# Altium project SAMA5D27-SOM1.PrjPcb (part 2 of 2)

## Sheet 7-SOM PIO.SchDoc
size 420 x 297 mm; CompanyName: Microchip Technology Inc.; Organization: Microchip Technology; Address1: 2355 West Chandler Blvd.; Address2: Chandler, AZ  85224; Address4: USA; SheetTitle: **; Time: Time
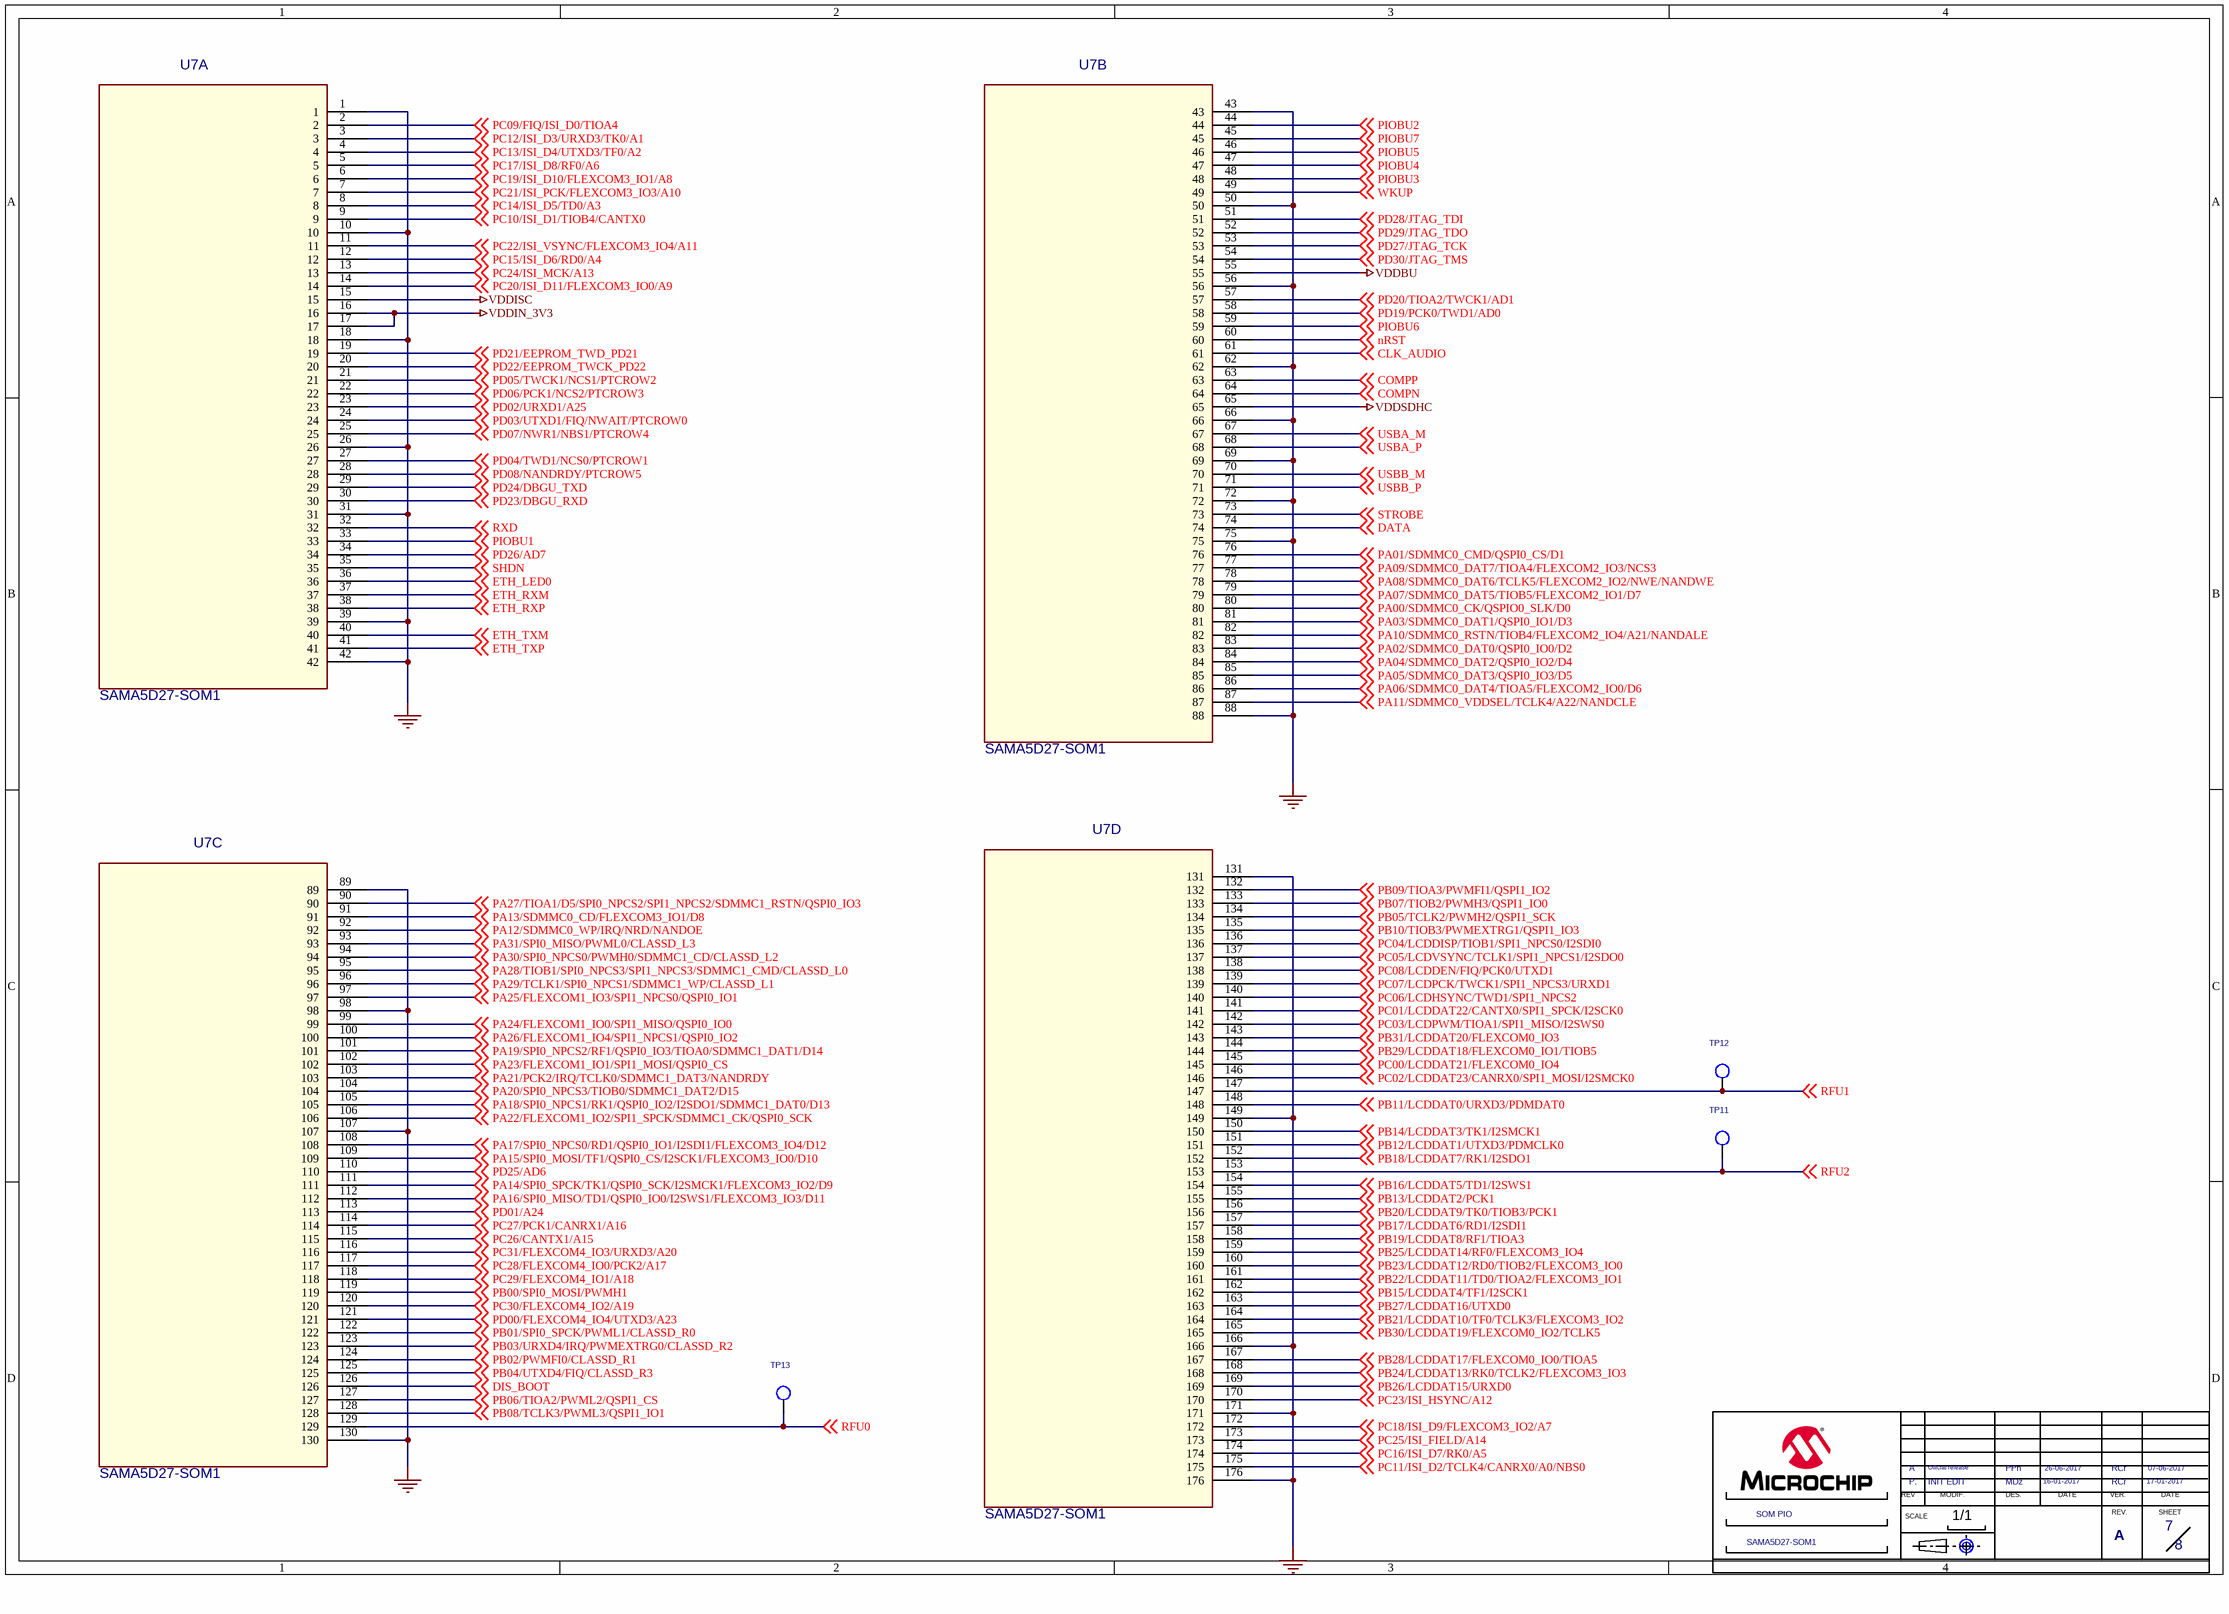
[diagram p6: 7-SOM PIO.SchDoc]

### Parts
(Parts that share a designator on the sheet are numbered #1, #2 ... from top to bottom, then left to right.)
*#7  MODIF.A: INIT EDIT  SHEET NAME 2: SOM PIO  SHEET NAME 1: SAMA5D27-SOM1  REV B: A  VERIF B: RCr  VERIF DATE A: 17-01-2017  VERIF DATE B: 07-06-2017  Page Count: 8  Page Number: 7  DATE A: 16-01-2017  DATE B: 26-06-2017  DES A: MDz  DES B: PPn  MODIF.B: Official release  REV A: P.  (hidden comment: CARTOUCHE MICROCHIP)  (graphical)
?#7  (no value)  (graphical)
TP11  TP  [tp-cmsrond-1mm_02]  (value not drawn)
TP12  TP  [tp-cmsrond-1mm_02]  (value not drawn)
TP13  TP  [tp-cmsrond-1mm_02]  (value not drawn)
U7  SAMA5D27-SOM1  [SAMA5D27-DXG-SOM1]  (parts A,B,C,D of 4)

### Nets
GND: U7.1 U7.10 U7.18 U7.26 U7.31 U7.39 U7.42 U7.43 U7.50 U7.56 U7.62 U7.66 U7.69 U7.72 U7.75 U7.88 U7.89 U7.98 U7.107 U7.130 U7.131 U7.149 U7.166 U7.171 U7.176
VDDBU: U7.55
VDDIN_3V3: U7.16 U7.17
VDDISC: U7.15
VDDSDHC: U7.65
CLK_AUDIO: U7.61 ; off-sheet CLK_AUDIO
COMPN: U7.64 ; off-sheet COMPN
COMPP: U7.63 ; off-sheet COMPP
DATA: U7.74 ; off-sheet DATA
DIS_BOOT: U7.126 ; off-sheet DIS_BOOT
ETH_LED0: U7.36 ; off-sheet ETH_LED0
ETH_RXM: U7.37 ; off-sheet ETH_RXM
ETH_RXP: U7.38 ; off-sheet ETH_RXP
ETH_TXM: U7.40 ; off-sheet ETH_TXM
ETH_TXP: U7.41 ; off-sheet ETH_TXP
nRST: U7.60 ; off-sheet nRST
PA00/SDMMC0_CK/QSPIO0_SLK/D0: U7.80 ; off-sheet PA00/SDMMC0_CK/QSPIO0_SLK/D0
PA01/SDMMC0_CMD/QSPI0_CS/D1: U7.76 ; off-sheet PA01/SDMMC0_CMD/QSPI0_CS/D1
PA02/SDMMC0_DAT0/QSPI0_IO0/D2: U7.83 ; off-sheet PA02/SDMMC0_DAT0/QSPI0_IO0/D2
PA03/SDMMC0_DAT1/QSPI0_IO1/D3: U7.81 ; off-sheet PA03/SDMMC0_DAT1/QSPI0_IO1/D3
PA04/SDMMC0_DAT2/QSPI0_IO2/D4: U7.84 ; off-sheet PA04/SDMMC0_DAT2/QSPI0_IO2/D4
PA05/SDMMC0_DAT3/QSPI0_IO3/D5: U7.85 ; off-sheet PA05/SDMMC0_DAT3/QSPI0_IO3/D5
PA06/SDMMC0_DAT4/TIOA5/FLEXCOM2_IO0/D6: U7.86 ; off-sheet PA06/SDMMC0_DAT4/TIOA5/FLEXCOM2_IO0/D6
PA07/SDMMC0_DAT5/TIOB5/FLEXCOM2_IO1/D7: U7.79 ; off-sheet PA07/SDMMC0_DAT5/TIOB5/FLEXCOM2_IO1/D7
PA08/SDMMC0_DAT6/TCLK5/FLEXCOM2_IO2/NWE/NANDWE: U7.78 ; off-sheet PA08/SDMMC0_DAT6/TCLK5/FLEXCOM2_IO2/NWE/NANDWE
PA09/SDMMC0_DAT7/TIOA4/FLEXCOM2_IO3/NCS3: U7.77 ; off-sheet PA09/SDMMC0_DAT7/TIOA4/FLEXCOM2_IO3/NCS3
PA10/SDMMC0_RSTN/TIOB4/FLEXCOM2_IO4/A21/NANDALE: U7.82 ; off-sheet PA10/SDMMC0_RSTN/TIOB4/FLEXCOM2_IO4/A21/NANDALE
PA11/SDMMC0_VDDSEL/TCLK4/A22/NANDCLE: U7.87 ; off-sheet PA11/SDMMC0_VDDSEL/TCLK4/A22/NANDCLE
PA12/SDMMC0_WP/IRQ/NRD/NANDOE: U7.92 ; off-sheet PA12/SDMMC0_WP/IRQ/NRD/NANDOE
PA13/SDMMC0_CD/FLEXCOM3_IO1/D8: U7.91 ; off-sheet PA13/SDMMC0_CD/FLEXCOM3_IO1/D8
PA14/SPI0_SPCK/TK1/QSPI0_SCK/I2SMCK1/FLEXCOM3_IO2/D9: U7.111 ; off-sheet PA14/SPI0_SPCK/TK1/QSPI0_SCK/I2SMCK1/FLEXCOM3_IO2/D9
PA15/SPI0_MOSI/TF1/QSPI0_CS/I2SCK1/FLEXCOM3_IO0/D10: U7.109 ; off-sheet PA15/SPI0_MOSI/TF1/QSPI0_CS/I2SCK1/FLEXCOM3_IO0/D10
PA16/SPI0_MISO/TD1/QSPI0_IO0/I2SWS1/FLEXCOM3_IO3/D11: U7.112 ; off-sheet PA16/SPI0_MISO/TD1/QSPI0_IO0/I2SWS1/FLEXCOM3_IO3/D11
PA17/SPI0_NPCS0/RD1/QSPI0_IO1/I2SDI1/FLEXCOM3_IO4/D12: U7.108 ; off-sheet PA17/SPI0_NPCS0/RD1/QSPI0_IO1/I2SDI1/FLEXCOM3_IO4/D12
PA18/SPI0_NPCS1/RK1/QSPI0_IO2/I2SDO1/SDMMC1_DAT0/D13: U7.105 ; off-sheet PA18/SPI0_NPCS1/RK1/QSPI0_IO2/I2SDO1/SDMMC1_DAT0/D13
PA19/SPI0_NPCS2/RF1/QSPI0_IO3/TIOA0/SDMMC1_DAT1/D14: U7.101 ; off-sheet PA19/SPI0_NPCS2/RF1/QSPI0_IO3/TIOA0/SDMMC1_DAT1/D14
PA20/SPI0_NPCS3/TIOB0/SDMMC1_DAT2/D15: U7.104 ; off-sheet PA20/SPI0_NPCS3/TIOB0/SDMMC1_DAT2/D15
PA21/PCK2/IRQ/TCLK0/SDMMC1_DAT3/NANDRDY: U7.103 ; off-sheet PA21/PCK2/IRQ/TCLK0/SDMMC1_DAT3/NANDRDY
PA22/FLEXCOM1_IO2/SPI1_SPCK/SDMMC1_CK/QSPI0_SCK: U7.106 ; off-sheet PA22/FLEXCOM1_IO2/SPI1_SPCK/SDMMC1_CK/QSPI0_SCK
PA23/FLEXCOM1_IO1/SPI1_MOSI/QSPI0_CS: U7.102 ; off-sheet PA23/FLEXCOM1_IO1/SPI1_MOSI/QSPI0_CS
PA24/FLEXCOM1_IO0/SPI1_MISO/QSPI0_IO0: U7.99 ; off-sheet PA24/FLEXCOM1_IO0/SPI1_MISO/QSPI0_IO0
PA25/FLEXCOM1_IO3/SPI1_NPCS0/QSPI0_IO1: U7.97 ; off-sheet PA25/FLEXCOM1_IO3/SPI1_NPCS0/QSPI0_IO1
PA26/FLEXCOM1_IO4/SPI1_NPCS1/QSPI0_IO2: U7.100 ; off-sheet PA26/FLEXCOM1_IO4/SPI1_NPCS1/QSPI0_IO2
PA27/TIOA1/D5/SPI0_NPCS2/SPI1_NPCS2/SDMMC1_RSTN/QSPI0_IO3: U7.90 ; off-sheet PA27/TIOA1/D5/SPI0_NPCS2/SPI1_NPCS2/SDMMC1_RSTN/QSPI0_IO3
PA28/TIOB1/SPI0_NPCS3/SPI1_NPCS3/SDMMC1_CMD/CLASSD_L0: U7.95 ; off-sheet PA28/TIOB1/SPI0_NPCS3/SPI1_NPCS3/SDMMC1_CMD/CLASSD_L0
PA29/TCLK1/SPI0_NPCS1/SDMMC1_WP/CLASSD_L1: U7.96 ; off-sheet PA29/TCLK1/SPI0_NPCS1/SDMMC1_WP/CLASSD_L1
PA30/SPI0_NPCS0/PWMH0/SDMMC1_CD/CLASSD_L2: U7.94 ; off-sheet PA30/SPI0_NPCS0/PWMH0/SDMMC1_CD/CLASSD_L2
PA31/SPI0_MISO/PWML0/CLASSD_L3: U7.93 ; off-sheet PA31/SPI0_MISO/PWML0/CLASSD_L3
PB00/SPI0_MOSI/PWMH1: U7.119 ; off-sheet PB00/SPI0_MOSI/PWMH1
PB01/SPI0_SPCK/PWML1/CLASSD_R0: U7.122 ; off-sheet PB01/SPI0_SPCK/PWML1/CLASSD_R0
PB02/PWMFI0/CLASSD_R1: U7.124 ; off-sheet PB02/PWMFI0/CLASSD_R1
PB03/URXD4/IRQ/PWMEXTRG0/CLASSD_R2: U7.123 ; off-sheet PB03/URXD4/IRQ/PWMEXTRG0/CLASSD_R2
PB04/UTXD4/FIQ/CLASSD_R3: U7.125 ; off-sheet PB04/UTXD4/FIQ/CLASSD_R3
PB05/TCLK2/PWMH2/QSPI1_SCK: U7.134 ; off-sheet PB05/TCLK2/PWMH2/QSPI1_SCK
PB06/TIOA2/PWML2/QSPI1_CS: U7.127 ; off-sheet PB06/TIOA2/PWML2/QSPI1_CS
PB07/TIOB2/PWMH3/QSPI1_IO0: U7.133 ; off-sheet PB07/TIOB2/PWMH3/QSPI1_IO0
PB08/TCLK3/PWML3/QSPI1_IO1: U7.128 ; off-sheet PB08/TCLK3/PWML3/QSPI1_IO1
PB09/TIOA3/PWMFI1/QSPI1_IO2: U7.132 ; off-sheet PB09/TIOA3/PWMFI1/QSPI1_IO2
PB10/TIOB3/PWMEXTRG1/QSPI1_IO3: U7.135 ; off-sheet PB10/TIOB3/PWMEXTRG1/QSPI1_IO3
PB11/LCDDAT0/URXD3/PDMDAT0: U7.148 ; off-sheet PB11/LCDDAT0/URXD3/PDMDAT0
PB12/LCDDAT1/UTXD3/PDMCLK0: U7.151 ; off-sheet PB12/LCDDAT1/UTXD3/PDMCLK0
PB13/LCDDAT2/PCK1: U7.155 ; off-sheet PB13/LCDDAT2/PCK1
PB14/LCDDAT3/TK1/I2SMCK1: U7.150 ; off-sheet PB14/LCDDAT3/TK1/I2SMCK1
PB15/LCDDAT4/TF1/I2SCK1: U7.162 ; off-sheet PB15/LCDDAT4/TF1/I2SCK1
PB16/LCDDAT5/TD1/I2SWS1: U7.154 ; off-sheet PB16/LCDDAT5/TD1/I2SWS1
PB17/LCDDAT6/RD1/I2SDI1: U7.157 ; off-sheet PB17/LCDDAT6/RD1/I2SDI1
PB18/LCDDAT7/RK1/I2SDO1: U7.152 ; off-sheet PB18/LCDDAT7/RK1/I2SDO1
PB19/LCDDAT8/RF1/TIOA3: U7.158 ; off-sheet PB19/LCDDAT8/RF1/TIOA3
PB20/LCDDAT9/TK0/TIOB3/PCK1: U7.156 ; off-sheet PB20/LCDDAT9/TK0/TIOB3/PCK1
PB21/LCDDAT10/TF0/TCLK3/FLEXCOM3_IO2: U7.164 ; off-sheet PB21/LCDDAT10/TF0/TCLK3/FLEXCOM3_IO2
PB22/LCDDAT11/TD0/TIOA2/FLEXCOM3_IO1: U7.161 ; off-sheet PB22/LCDDAT11/TD0/TIOA2/FLEXCOM3_IO1
PB23/LCDDAT12/RD0/TIOB2/FLEXCOM3_IO0: U7.160 ; off-sheet PB23/LCDDAT12/RD0/TIOB2/FLEXCOM3_IO0
PB24/LCDDAT13/RK0/TCLK2/FLEXCOM3_IO3: U7.168 ; off-sheet PB24/LCDDAT13/RK0/TCLK2/FLEXCOM3_IO3
PB25/LCDDAT14/RF0/FLEXCOM3_IO4: U7.159 ; off-sheet PB25/LCDDAT14/RF0/FLEXCOM3_IO4
PB26/LCDDAT15/URXD0: U7.169 ; off-sheet PB26/LCDDAT15/URXD0
PB27/LCDDAT16/UTXD0: U7.163 ; off-sheet PB27/LCDDAT16/UTXD0
PB28/LCDDAT17/FLEXCOM0_IO0/TIOA5: U7.167 ; off-sheet PB28/LCDDAT17/FLEXCOM0_IO0/TIOA5
PB29/LCDDAT18/FLEXCOM0_IO1/TIOB5: U7.144 ; off-sheet PB29/LCDDAT18/FLEXCOM0_IO1/TIOB5
PB30/LCDDAT19/FLEXCOM0_IO2/TCLK5: U7.165 ; off-sheet PB30/LCDDAT19/FLEXCOM0_IO2/TCLK5
PB31/LCDDAT20/FLEXCOM0_IO3: U7.143 ; off-sheet PB31/LCDDAT20/FLEXCOM0_IO3
PC00/LCDDAT21/FLEXCOM0_IO4: U7.145 ; off-sheet PC00/LCDDAT21/FLEXCOM0_IO4
PC01/LCDDAT22/CANTX0/SPI1_SPCK/I2SCK0: U7.141 ; off-sheet PC01/LCDDAT22/CANTX0/SPI1_SPCK/I2SCK0
PC02/LCDDAT23/CANRX0/SPI1_MOSI/I2SMCK0: U7.146 ; off-sheet PC02/LCDDAT23/CANRX0/SPI1_MOSI/I2SMCK0
PC03/LCDPWM/TIOA1/SPI1_MISO/I2SWS0: U7.142 ; off-sheet PC03/LCDPWM/TIOA1/SPI1_MISO/I2SWS0
PC04/LCDDISP/TIOB1/SPI1_NPCS0/I2SDI0: U7.136 ; off-sheet PC04/LCDDISP/TIOB1/SPI1_NPCS0/I2SDI0
PC05/LCDVSYNC/TCLK1/SPI1_NPCS1/I2SDO0: U7.137 ; off-sheet PC05/LCDVSYNC/TCLK1/SPI1_NPCS1/I2SDO0
PC06/LCDHSYNC/TWD1/SPI1_NPCS2: U7.140 ; off-sheet PC06/LCDHSYNC/TWD1/SPI1_NPCS2
PC07/LCDPCK/TWCK1/SPI1_NPCS3/URXD1: U7.139 ; off-sheet PC07/LCDPCK/TWCK1/SPI1_NPCS3/URXD1
PC08/LCDDEN/FIQ/PCK0/UTXD1: U7.138 ; off-sheet PC08/LCDDEN/FIQ/PCK0/UTXD1
PC09/FIQ/ISI_D0/TIOA4: U7.2 ; off-sheet PC09/FIQ/ISI_D0/TIOA4
PC10/ISI_D1/TIOB4/CANTX0: U7.9 ; off-sheet PC10/ISI_D1/TIOB4/CANTX0
PC11/ISI_D2/TCLK4/CANRX0/A0/NBS0: U7.175 ; off-sheet PC11/ISI_D2/TCLK4/CANRX0/A0/NBS0
PC12/ISI_D3/URXD3/TK0/A1: U7.3 ; off-sheet PC12/ISI_D3/URXD3/TK0/A1
PC13/ISI_D4/UTXD3/TF0/A2: U7.4 ; off-sheet PC13/ISI_D4/UTXD3/TF0/A2
PC14/ISI_D5/TD0/A3: U7.8 ; off-sheet PC14/ISI_D5/TD0/A3
PC15/ISI_D6/RD0/A4: U7.12 ; off-sheet PC15/ISI_D6/RD0/A4
PC16/ISI_D7/RK0/A5: U7.174 ; off-sheet PC16/ISI_D7/RK0/A5
PC17/ISI_D8/RF0/A6: U7.5 ; off-sheet PC17/ISI_D8/RF0/A6
PC18/ISI_D9/FLEXCOM3_IO2/A7: U7.172 ; off-sheet PC18/ISI_D9/FLEXCOM3_IO2/A7
PC19/ISI_D10/FLEXCOM3_IO1/A8: U7.6 ; off-sheet PC19/ISI_D10/FLEXCOM3_IO1/A8
PC20/ISI_D11/FLEXCOM3_IO0/A9: U7.14 ; off-sheet PC20/ISI_D11/FLEXCOM3_IO0/A9
PC21/ISI_PCK/FLEXCOM3_IO3/A10: U7.7 ; off-sheet PC21/ISI_PCK/FLEXCOM3_IO3/A10
PC22/ISI_VSYNC/FLEXCOM3_IO4/A11: U7.11 ; off-sheet PC22/ISI_VSYNC/FLEXCOM3_IO4/A11
PC23/ISI_HSYNC/A12: U7.170 ; off-sheet PC23/ISI_HSYNC/A12
PC24/ISI_MCK/A13: U7.13 ; off-sheet PC24/ISI_MCK/A13
PC25/ISI_FIELD/A14: U7.173 ; off-sheet PC25/ISI_FIELD/A14
PC26/CANTX1/A15: U7.115 ; off-sheet PC26/CANTX1/A15
PC27/PCK1/CANRX1/A16: U7.114 ; off-sheet PC27/PCK1/CANRX1/A16
PC28/FLEXCOM4_IO0/PCK2/A17: U7.117 ; off-sheet PC28/FLEXCOM4_IO0/PCK2/A17
PC29/FLEXCOM4_IO1/A18: U7.118 ; off-sheet PC29/FLEXCOM4_IO1/A18
PC30/FLEXCOM4_IO2/A19: U7.120 ; off-sheet PC30/FLEXCOM4_IO2/A19
PC31/FLEXCOM4_IO3/URXD3/A20: U7.116 ; off-sheet PC31/FLEXCOM4_IO3/URXD3/A20
PD00/FLEXCOM4_IO4/UTXD3/A23: U7.121 ; off-sheet PD00/FLEXCOM4_IO4/UTXD3/A23
PD01/A24: U7.113 ; off-sheet PD01/A24
PD02/URXD1/A25: U7.23 ; off-sheet PD02/URXD1/A25
PD03/UTXD1/FIQ/NWAIT/PTCROW0: U7.24 ; off-sheet PD03/UTXD1/FIQ/NWAIT/PTCROW0
PD04/TWD1/NCS0/PTCROW1: U7.27 ; off-sheet PD04/TWD1/NCS0/PTCROW1
PD05/TWCK1/NCS1/PTCROW2: U7.21 ; off-sheet PD05/TWCK1/NCS1/PTCROW2
PD06/PCK1/NCS2/PTCROW3: U7.22 ; off-sheet PD06/PCK1/NCS2/PTCROW3
PD07/NWR1/NBS1/PTCROW4: U7.25 ; off-sheet PD07/NWR1/NBS1/PTCROW4
PD08/NANDRDY/PTCROW5: U7.28 ; off-sheet PD08/NANDRDY/PTCROW5
PD19/PCK0/TWD1/AD0: U7.58 ; off-sheet PD19/PCK0/TWD1/AD0
PD20/TIOA2/TWCK1/AD1: U7.57 ; off-sheet PD20/TIOA2/TWCK1/AD1
PD21/EEPROM_TWD_PD21: U7.19 ; off-sheet PD21/EEPROM_TWD_PD21
PD22/EEPROM_TWCK_PD22: U7.20 ; off-sheet PD22/EEPROM_TWCK_PD22
PD23/DBGU_RXD: U7.30 ; off-sheet PD23/DBGU_RXD
PD24/DBGU_TXD: U7.29 ; off-sheet PD24/DBGU_TXD
PD25/AD6: U7.110 ; off-sheet PD25/AD6
PD26/AD7: U7.34 ; off-sheet PD26/AD7
PD27/JTAG_TCK: U7.53 ; off-sheet PD27/JTAG_TCK
PD28/JTAG_TDI: U7.51 ; off-sheet PD28/JTAG_TDI
PD29/JTAG_TDO: U7.52 ; off-sheet PD29/JTAG_TDO
PD30/JTAG_TMS: U7.54 ; off-sheet PD30/JTAG_TMS
PIOBU1: U7.33 ; off-sheet PIOBU1
PIOBU2: U7.44 ; off-sheet PIOBU2
PIOBU3: U7.48 ; off-sheet PIOBU3
PIOBU4: U7.47 ; off-sheet PIOBU4
PIOBU5: U7.46 ; off-sheet PIOBU5
PIOBU6: U7.59 ; off-sheet PIOBU6
PIOBU7: U7.45 ; off-sheet PIOBU7
RFU0: TP13.1 U7.129 ; off-sheet RFU0
RFU1: TP12.1 U7.147 ; off-sheet RFU1
RFU2: TP11.1 U7.153 ; off-sheet RFU2
RXD: U7.32 ; off-sheet RXD
SHDN: U7.35 ; off-sheet SHDN
STROBE: U7.73 ; off-sheet STROBE
USBA_M: U7.67 ; off-sheet USBA_M
USBA_P: U7.68 ; off-sheet USBA_P
USBB_M: U7.70 ; off-sheet USBB_M
USBB_P: U7.71 ; off-sheet USBB_P
WKUP: U7.49 ; off-sheet WKUP

### Notes on the sheet
- Drawn By:
- Engineer:
- PartNumber:
- Project Title
- Sheet Title
- Size
- B
- Revision:
- Sch #:
- Date:
- Sheet
- Designed with
- Altium.com <http://go.altium.com/MicrochipLandingPage_Evaluation.html>
- File:
- (in symbol CARTOUCHE MICROCHIP) REV; MODIF.; DES.; DATE; VER.; SCALE; REV.; SHEET; 1/1

### Library data of the parts
*#7 = CARTOUCHE MICROCHIP: REV D: D; REV C: C; REV F: F; REV E: E; VERIF F: XXX; VERIF DATE F: XX-XXX-XX; MODIF.C: RevC; MODIF.D: RevD; MODIF.E: RevE; MODIF.F: RevF; VERIF E: XXX; VERIF D: XXX; VERIF C: RCr; VERIF A: RCr; VERIF DATE E: XX-XXX-XX; VERIF DATE D: XX-XXX-XX; VERIF DATE C: 07-06-2017; REV: A; FT: ?; Page Size: A; Page Create Date: june 19, 2004; DATE C: 07-06-2017; DATE D: XX-XXX-XX; DATE E: XX-XXX-XX; DATE F: XX-XXX-XX; DES E: XXX; DES F: XXX; DES C: XXX; DES D: XXX
?#7 = Title Block B
TP11-TP13 = TP: DESIGNATION: POINT DE TEST
U7 = SAMA5D27-SOM1-2

## Sheet 8-Mechanical.SchDoc
size 420 x 297 mm; CompanyName: Microchip Technology Inc.; Organization: Microchip Technology; Address1: 2355 West Chandler Blvd.; Address2: Chandler, AZ  85224; Address4: USA; SheetTitle: **; Time: Time
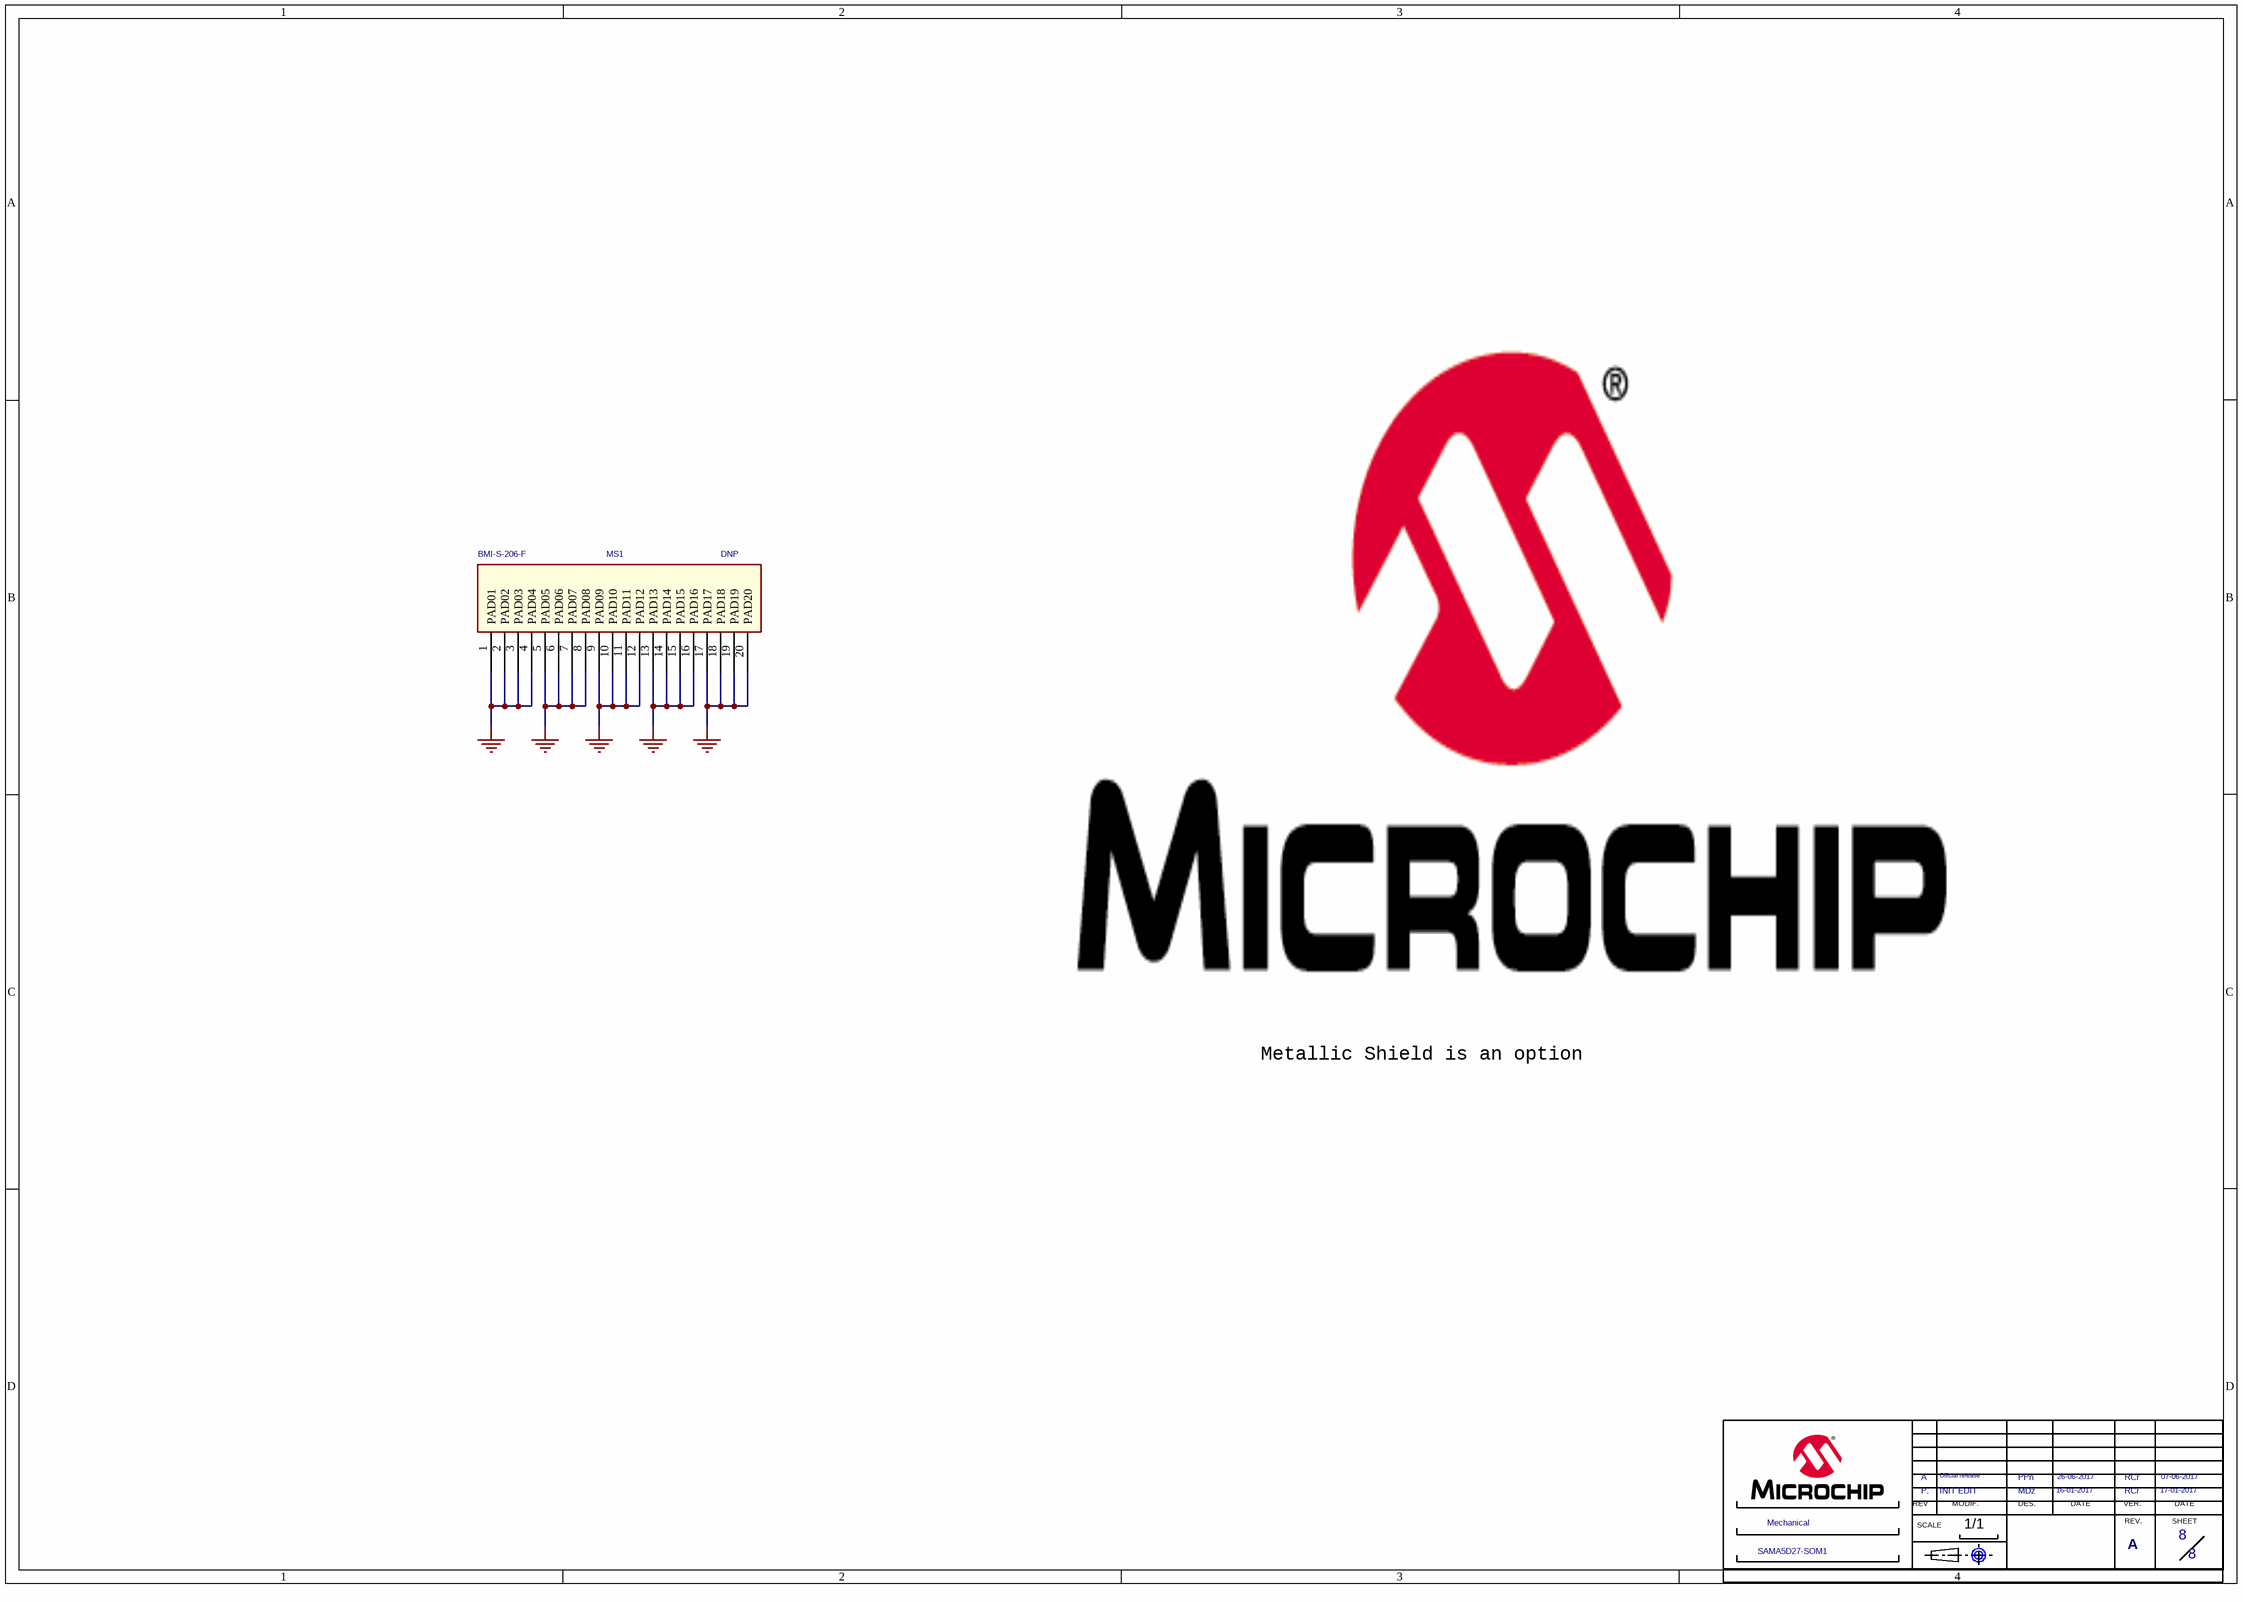
[diagram p7: 8-Mechanical.SchDoc]

### Parts
(Parts that share a designator on the sheet are numbered #1, #2 ... from top to bottom, then left to right.)
*#8  MODIF.A: INIT EDIT  SHEET NAME 2: Mechanical  SHEET NAME 1: SAMA5D27-SOM1  REV B: A  VERIF B: RCr  VERIF DATE A: 17-01-2017  VERIF DATE B: 07-06-2017  Page Count: 8  DATE A: 16-01-2017  DATE B: 26-06-2017  DES A: MDz  DES B: PPn  MODIF.B: Official release  REV A: P.  (hidden comment: CARTOUCHE MICROCHIP)  (graphical)
?#8  (no value)  (graphical)
MS1  ?  [BMI-S-206-F_01]  (value not drawn)

### Nets
GND: MS1.1(PAD01) MS1.2(PAD02) MS1.3(PAD03) MS1.4(PAD04) MS1.5(PAD05) MS1.6(PAD06) MS1.7(PAD07) MS1.8(PAD08) MS1.9(PAD09) MS1.10(PAD10) MS1.11(PAD11) MS1.12(PAD12) MS1.13(PAD13) MS1.14(PAD14) MS1.15(PAD15) MS1.16(PAD16) MS1.17(PAD17) MS1.18(PAD18) MS1.19(PAD19) MS1.20(PAD20)

### Notes on the sheet
- Metallic Shield is an option
- Drawn By:
- Engineer:
- PartNumber:
- Project Title
- Sheet Title
- Size
- B
- Revision:
- Sch #:
- Date:
- Sheet
- Designed with
- Altium.com <http://go.altium.com/MicrochipLandingPage_Evaluation.html>
- File:
- (in symbol CARTOUCHE MICROCHIP) REV; MODIF.; DES.; DATE; VER.; SCALE; REV.; SHEET; 1/1

### Library data of the parts
*#8 = CARTOUCHE MICROCHIP: as *#7 on sheet 7-SOM PIO; VERIF E: XXX; VERIF D: XXX; VERIF C: RCr; VERIF A: RCr; VERIF DATE E: XX-XXX-XX; VERIF DATE D: XX-XXX-XX; VERIF DATE C: 07-06-2017; REV: A; FT: ?; Page Number: 8; Page Size: A; Page Create Date: june 19, 2004; DATE C: 07-06-2017; DATE D: XX-XXX-XX; DATE E: XX-XXX-XX; DATE F: XX-XXX-XX; DES E: XXX; DES F: XXX; DES C: XXX; DES D: XXX
?#8 = Title Block B
MS1 = BMI-S-206-F: FABRICANT: Laird Technology; DESIGNATION: Metallic shield frame; Valeur: BMI-S-206-F; partnumber: BMI-S-206-F; type: ???; DNP: DNP

## Nets that join several sheets
GND: 2-Supplies (14 pins), 4-Microcontroller (86 pins), 5-Memories (44 pins), 6-Ethernet (14 pins), 7-SOM PIO (25 pins), 8-Mechanical (20 pins)
VDDBU: 2-Supplies (R1.2 R4.2), 4-Microcontroller (C58.2 U2.U5), 7-SOM PIO (U7.55)
VDDCORE: 2-Supplies (C8.2 U1.11), 4-Microcontroller (23 pins)
VDDFUSE: 2-Supplies (C1.1 U1.8), 4-Microcontroller (C57.2 TP5.1 U2.N13)
VDDIN_3V3: 2-Supplies (5 pins), 4-Microcontroller (8 pins), 5-Memories (16 pins), 6-Ethernet (7 pins), 7-SOM PIO (U7.16 U7.17)
VDDIODDR: 2-Supplies (5 pins), 4-Microcontroller (23 pins), 5-Memories (38 pins)
VDDISC: 4-Microcontroller (C55.2 U2.H3), 7-SOM PIO (U7.15)
VDDSDHC: 4-Microcontroller (C56.2 U2.N8), 7-SOM PIO (U7.65)
CLK_AUDIO: 4-Microcontroller (U2.T8), 7-SOM PIO (U7.61)
COMPN: 4-Microcontroller (R16.2), 7-SOM PIO (U7.64)
COMPP: 4-Microcontroller (R13.2), 7-SOM PIO (U7.63)
DATA: 4-Microcontroller (U2.T12), 7-SOM PIO (U7.74)
DIS_BOOT: 5-Memories (R33.2 U5.1), 7-SOM PIO (U7.126)
EEPROM_TWCK_PD22: 3-Microcontroller (U2.L6), 5-Memories (R22.1 R24.2 R26.2)
EEPROM_TWD_PD21: 3-Microcontroller (U2.P1), 5-Memories (R23.1 R25.2 R27.2)
ETH_INT_IRQ_PD31: 3-Microcontroller (U2.M8), 6-Ethernet (R48.1 U6.18)
ETH_LED0: 6-Ethernet (R52.1 U6.23), 7-SOM PIO (U7.36)
ETH_RXM: 6-Ethernet (U6.3), 7-SOM PIO (U7.37)
ETH_RXP: 6-Ethernet (U6.4), 7-SOM PIO (U7.38)
ETH_TXM: 6-Ethernet (U6.5), 7-SOM PIO (U7.40)
ETH_TXP: 6-Ethernet (U6.6), 7-SOM PIO (U7.41)
GMDC_PD17: 3-Microcontroller (U2.K1), 6-Ethernet (U6.11)
GMDIO_PD18: 3-Microcontroller (U2.J7), 6-Ethernet (R49.1 U6.10)
GRX0_PD13: 3-Microcontroller (U2.N1), 6-Ethernet (U6.13)
GRX1_PD14: 3-Microcontroller (U2.K5), 6-Ethernet (U6.12)
GRXDV_PD11: 3-Microcontroller (U2.K2), 6-Ethernet (R51.2 U6.15)
GRXER_PD12: 3-Microcontroller (U2.K9), 6-Ethernet (U6.17)
GTX0_PD15: 3-Microcontroller (U2.K8), 6-Ethernet (U6.20)
GTX1_PD16: 3-Microcontroller (U2.L1), 6-Ethernet (U6.21)
GTXCK_PD09: 3-Microcontroller (U2.J4), 6-Ethernet (U6.16)
GTXEN_PD10: 3-Microcontroller (U2.J3), 6-Ethernet (U6.19)
LOWQ#: 2-Supplies (R1.1 U1.1), 4-Microcontroller (U2.P3)
nRST: 2-Supplies (Q1.3 R2.1 U1.12), 4-Microcontroller (R10.1), 6-Ethernet (R53.2), 7-SOM PIO (U7.60)
PA00/SDMMC0_CK/QSPIO0_SLK/D0: 3-Microcontroller (U2.U13), 7-SOM PIO (U7.80)
PA01/SDMMC0_CMD/QSPI0_CS/D1: 3-Microcontroller (U2.N7), 7-SOM PIO (U7.76)
PA02/SDMMC0_DAT0/QSPI0_IO0/D2: 3-Microcontroller (U2.U14), 7-SOM PIO (U7.83)
PA03/SDMMC0_DAT1/QSPI0_IO1/D3: 3-Microcontroller (U2.T13), 7-SOM PIO (U7.81)
PA04/SDMMC0_DAT2/QSPI0_IO2/D4: 3-Microcontroller (U2.U15), 7-SOM PIO (U7.84)
PA05/SDMMC0_DAT3/QSPI0_IO3/D5: 3-Microcontroller (U2.U16), 7-SOM PIO (U7.85)
PA06/SDMMC0_DAT4/TIOA5/FLEXCOM2_IO0/D6: 3-Microcontroller (U2.U17), 7-SOM PIO (U7.86)
PA07/SDMMC0_DAT5/TIOB5/FLEXCOM2_IO1/D7: 3-Microcontroller (U2.R11), 7-SOM PIO (U7.79)
PA08/SDMMC0_DAT6/TCLK5/FLEXCOM2_IO2/NWE/NANDWE: 3-Microcontroller (U2.R9), 7-SOM PIO (U7.78)
PA09/SDMMC0_DAT7/TIOA4/FLEXCOM2_IO3/NCS3: 3-Microcontroller (U2.P8), 7-SOM PIO (U7.77)
PA10/SDMMC0_RSTN/TIOB4/FLEXCOM2_IO4/A21/NANDALE: 3-Microcontroller (U2.R10), 7-SOM PIO (U7.82)
PA11/SDMMC0_VDDSEL/TCLK4/A22/NANDCLE: 3-Microcontroller (U2.P15), 7-SOM PIO (U7.87)
PA12/SDMMC0_WP/IRQ/NRD/NANDOE: 3-Microcontroller (U2.N17), 7-SOM PIO (U7.92)
PA13/SDMMC0_CD/FLEXCOM3_IO1/D8: 3-Microcontroller (U2.P16), 7-SOM PIO (U7.91)
PA14/SPI0_SPCK/TK1/QSPI0_SCK/I2SMCK1/FLEXCOM3_IO2/D9: 3-Microcontroller (U2.M17), 7-SOM PIO (U7.111)
PA15/SPI0_MOSI/TF1/QSPI0_CS/I2SCK1/FLEXCOM3_IO0/D10: 3-Microcontroller (U2.N16), 7-SOM PIO (U7.109)
PA16/SPI0_MISO/TD1/QSPI0_IO0/I2SWS1/FLEXCOM3_IO3/D11: 3-Microcontroller (U2.M11), 7-SOM PIO (U7.112)
PA17/SPI0_NPCS0/RD1/QSPI0_IO1/I2SDI1/FLEXCOM3_IO4/D12: 3-Microcontroller (U2.N14), 7-SOM PIO (U7.108)
PA18/SPI0_NPCS1/RK1/QSPI0_IO2/I2SDO1/SDMMC1_DAT0/D13: 3-Microcontroller (U2.T16), 7-SOM PIO (U7.105)
PA19/SPI0_NPCS2/RF1/QSPI0_IO3/TIOA0/SDMMC1_DAT1/D14: 3-Microcontroller (U2.T15), 7-SOM PIO (U7.101)
PA20/SPI0_NPCS3/TIOB0/SDMMC1_DAT2/D15: 3-Microcontroller (U2.P9), 7-SOM PIO (U7.104)
PA21/PCK2/IRQ/TCLK0/SDMMC1_DAT3/NANDRDY: 3-Microcontroller (U2.P10), 7-SOM PIO (U7.103)
PA22/FLEXCOM1_IO2/SPI1_SPCK/SDMMC1_CK/QSPI0_SCK: 3-Microcontroller (U2.T17), 7-SOM PIO (U7.106)
PA23/FLEXCOM1_IO1/SPI1_MOSI/QSPI0_CS: 3-Microcontroller (U2.T14), 7-SOM PIO (U7.102)
PA24/FLEXCOM1_IO0/SPI1_MISO/QSPI0_IO0: 3-Microcontroller (U2.R17), 7-SOM PIO (U7.99)
PA25/FLEXCOM1_IO3/SPI1_NPCS0/QSPI0_IO1: 3-Microcontroller (U2.R16), 7-SOM PIO (U7.97)
PA26/FLEXCOM1_IO4/SPI1_NPCS1/QSPI0_IO2: 3-Microcontroller (U2.P17), 7-SOM PIO (U7.100)
PA27/TIOA1/D5/SPI0_NPCS2/SPI1_NPCS2/SDMMC1_RSTN/QSPI0_IO3: 3-Microcontroller (U2.R15), 7-SOM PIO (U7.90)
PA28/TIOB1/SPI0_NPCS3/SPI1_NPCS3/SDMMC1_CMD/CLASSD_L0: 3-Microcontroller (U2.R14), 7-SOM PIO (U7.95)
PA29/TCLK1/SPI0_NPCS1/SDMMC1_WP/CLASSD_L1: 3-Microcontroller (U2.P14), 7-SOM PIO (U7.96)
PA30/SPI0_NPCS0/PWMH0/SDMMC1_CD/CLASSD_L2: 3-Microcontroller (U2.R13), 7-SOM PIO (U7.94)
PA31/SPI0_MISO/PWML0/CLASSD_L3: 3-Microcontroller (U2.P13), 7-SOM PIO (U7.93)
PB00/SPI0_MOSI/PWMH1: 3-Microcontroller (U2.F5), 7-SOM PIO (U7.119)
PB01/SPI0_SPCK/PWML1/CLASSD_R0: 3-Microcontroller (U2.C8), 7-SOM PIO (U7.122)
PB02/PWMFI0/CLASSD_R1: 3-Microcontroller (U2.C7), 7-SOM PIO (U7.124)
PB03/URXD4/IRQ/PWMEXTRG0/CLASSD_R2: 3-Microcontroller (U2.B8), 7-SOM PIO (U7.123)
PB04/UTXD4/FIQ/CLASSD_R3: 3-Microcontroller (U2.B7), 7-SOM PIO (U7.125)
PB05/TCLK2/PWMH2/QSPI1_SCK: 5-Memories (R47.2), 7-SOM PIO (U7.134)
PB06/TIOA2/PWML2/QSPI1_CS: 5-Memories (R44.1), 7-SOM PIO (U7.127)
PB07/TIOB2/PWMH3/QSPI1_IO0: 5-Memories (R42.2), 7-SOM PIO (U7.133)
PB08/TCLK3/PWML3/QSPI1_IO1: 5-Memories (R43.2), 7-SOM PIO (U7.128)
PB09/TIOA3/PWMFI1/QSPI1_IO2: 5-Memories (R45.2), 7-SOM PIO (U7.132)
PB10/TIOB3/PWMEXTRG1/QSPI1_IO3: 5-Memories (R46.2), 7-SOM PIO (U7.135)
PB11/LCDDAT0/URXD3/PDMDAT0: 3-Microcontroller (U2.A7), 7-SOM PIO (U7.148)
PB12/LCDDAT1/UTXD3/PDMCLK0: 3-Microcontroller (U2.B6), 7-SOM PIO (U7.151)
PB13/LCDDAT2/PCK1: 3-Microcontroller (U2.C5), 7-SOM PIO (U7.155)
PB14/LCDDAT3/TK1/I2SMCK1: 3-Microcontroller (U2.A6), 7-SOM PIO (U7.150)
PB15/LCDDAT4/TF1/I2SCK1: 3-Microcontroller (U2.E4), 7-SOM PIO (U7.162)
PB16/LCDDAT5/TD1/I2SWS1: 3-Microcontroller (U2.B5), 7-SOM PIO (U7.154)
PB17/LCDDAT6/RD1/I2SDI1: 3-Microcontroller (U2.C4), 7-SOM PIO (U7.157)
PB18/LCDDAT7/RK1/I2SDO1: 3-Microcontroller (U2.A5), 7-SOM PIO (U7.152)
PB19/LCDDAT8/RF1/TIOA3: 3-Microcontroller (U2.B4), 7-SOM PIO (U7.158)
PB20/LCDDAT9/TK0/TIOB3/PCK1: 3-Microcontroller (U2.A4), 7-SOM PIO (U7.156)
PB21/LCDDAT10/TF0/TCLK3/FLEXCOM3_IO2: 3-Microcontroller (U2.D3), 7-SOM PIO (U7.164)
PB22/LCDDAT11/TD0/TIOA2/FLEXCOM3_IO1: 3-Microcontroller (U2.C3), 7-SOM PIO (U7.161)
PB23/LCDDAT12/RD0/TIOB2/FLEXCOM3_IO0: 3-Microcontroller (U2.B3), 7-SOM PIO (U7.160)
PB24/LCDDAT13/RK0/TCLK2/FLEXCOM3_IO3: 3-Microcontroller (U2.E2), 7-SOM PIO (U7.168)
PB25/LCDDAT14/RF0/FLEXCOM3_IO4: 3-Microcontroller (U2.A3), 7-SOM PIO (U7.159)
PB26/LCDDAT15/URXD0: 3-Microcontroller (U2.G3), 7-SOM PIO (U7.169)
PB27/LCDDAT16/UTXD0: 3-Microcontroller (U2.F4), 7-SOM PIO (U7.163)
PB28/LCDDAT17/FLEXCOM0_IO0/TIOA5: 3-Microcontroller (U2.D2), 7-SOM PIO (U7.167)
PB29/LCDDAT18/FLEXCOM0_IO1/TIOB5: 3-Microcontroller (U2.G8), 7-SOM PIO (U7.144)
PB30/LCDDAT19/FLEXCOM0_IO2/TCLK5: 3-Microcontroller (U2.C2), 7-SOM PIO (U7.165)
PB31/LCDDAT20/FLEXCOM0_IO3: 3-Microcontroller (U2.G7), 7-SOM PIO (U7.143)
PC00/LCDDAT21/FLEXCOM0_IO4: 3-Microcontroller (U2.N10), 7-SOM PIO (U7.145)
PC01/LCDDAT22/CANTX0/SPI1_SPCK/I2SCK0: 3-Microcontroller (U2.N11), 7-SOM PIO (U7.141)
PC02/LCDDAT23/CANRX0/SPI1_MOSI/I2SMCK0: 3-Microcontroller (U2.N9), 7-SOM PIO (U7.146)
PC03/LCDPWM/TIOA1/SPI1_MISO/I2SWS0: 3-Microcontroller (U2.M10), 7-SOM PIO (U7.142)
PC04/LCDDISP/TIOB1/SPI1_NPCS0/I2SDI0: 3-Microcontroller (U2.N15), 7-SOM PIO (U7.136)
PC05/LCDVSYNC/TCLK1/SPI1_NPCS1/I2SDO0: 3-Microcontroller (U2.M16), 7-SOM PIO (U7.137)
PC06/LCDHSYNC/TWD1/SPI1_NPCS2: 3-Microcontroller (U2.L11), 7-SOM PIO (U7.140)
PC07/LCDPCK/TWCK1/SPI1_NPCS3/URXD1: 3-Microcontroller (U2.M15), 7-SOM PIO (U7.139)
PC08/LCDDEN/FIQ/PCK0/UTXD1: 3-Microcontroller (U2.M13), 7-SOM PIO (U7.138)
PC09/FIQ/ISI_D0/TIOA4: 3-Microcontroller (U2.B2), 7-SOM PIO (U7.2)
PC10/ISI_D1/TIOB4/CANTX0: 3-Microcontroller (U2.G4), 7-SOM PIO (U7.9)
PC11/ISI_D2/TCLK4/CANRX0/A0/NBS0: 3-Microcontroller (U2.A2), 7-SOM PIO (U7.175)
PC12/ISI_D3/URXD3/TK0/A1: 3-Microcontroller (U2.A1), 7-SOM PIO (U7.3)
PC13/ISI_D4/UTXD3/TF0/A2: 3-Microcontroller (U2.B1), 7-SOM PIO (U7.4)
PC14/ISI_D5/TD0/A3: 3-Microcontroller (U2.G5), 7-SOM PIO (U7.8)
PC15/ISI_D6/RD0/A4: 3-Microcontroller (U2.G2), 7-SOM PIO (U7.12)
PC16/ISI_D7/RK0/A5: 3-Microcontroller (U2.G6), 7-SOM PIO (U7.174)
PC17/ISI_D8/RF0/A6: 3-Microcontroller (U2.C1), 7-SOM PIO (U7.5)
PC18/ISI_D9/FLEXCOM3_IO2/A7: 3-Microcontroller (U2.G9), 7-SOM PIO (U7.172)
PC19/ISI_D10/FLEXCOM3_IO1/A8: 3-Microcontroller (U2.D1), 7-SOM PIO (U7.6)
PC20/ISI_D11/FLEXCOM3_IO0/A9: 3-Microcontroller (U2.H4), 7-SOM PIO (U7.14)
PC21/ISI_PCK/FLEXCOM3_IO3/A10: 3-Microcontroller (U2.E1), 7-SOM PIO (U7.7)
PC22/ISI_VSYNC/FLEXCOM3_IO4/A11: 3-Microcontroller (U2.F1), 7-SOM PIO (U7.11)
PC23/ISI_HSYNC/A12: 3-Microcontroller (U2.H9), 7-SOM PIO (U7.170)
PC24/ISI_MCK/A13: 3-Microcontroller (U2.G1), 7-SOM PIO (U7.13)
PC25/ISI_FIELD/A14: 3-Microcontroller (U2.H8), 7-SOM PIO (U7.173)
PC26/CANTX1/A15: 3-Microcontroller (U2.F7), 7-SOM PIO (U7.115)
PC27/PCK1/CANRX1/A16: 3-Microcontroller (U2.B10), 7-SOM PIO (U7.114)
PC28/FLEXCOM4_IO0/PCK2/A17: 3-Microcontroller (U2.F6), 7-SOM PIO (U7.117)
PC29/FLEXCOM4_IO1/A18: 3-Microcontroller (U2.B9), 7-SOM PIO (U7.118)
PC30/FLEXCOM4_IO2/A19: 3-Microcontroller (U2.E6), 7-SOM PIO (U7.120)
PC31/FLEXCOM4_IO3/URXD3/A20: 3-Microcontroller (U2.A11), 7-SOM PIO (U7.116)
PD00/FLEXCOM4_IO4/UTXD3/A23: 3-Microcontroller (U2.E7), 7-SOM PIO (U7.121)
PD01/A24: 3-Microcontroller (U2.C9), 7-SOM PIO (U7.113)
PD02/URXD1/A25: 3-Microcontroller (U2.D8), 7-SOM PIO (U7.23)
PD03/UTXD1/FIQ/NWAIT/PTCROW0: 3-Microcontroller (U2.J1), 7-SOM PIO (U7.24)
PD04/TWD1/NCS0/PTCROW1: 3-Microcontroller (U2.H7), 7-SOM PIO (U7.27)
PD05/TWCK1/NCS1/PTCROW2: 3-Microcontroller (U2.H1), 7-SOM PIO (U7.21)
PD06/PCK1/NCS2/PTCROW3: 3-Microcontroller (U2.J2), 7-SOM PIO (U7.22)
PD07/NWR1/NBS1/PTCROW4: 3-Microcontroller (U2.H6), 7-SOM PIO (U7.25)
PD08/NANDRDY/PTCROW5: 3-Microcontroller (U2.K3), 7-SOM PIO (U7.28)
PD19/PCK0/TWD1/AD0: 3-Microcontroller (U2.L8), 7-SOM PIO (U7.58)
PD20/TIOA2/TWCK1/AD1: 3-Microcontroller (U2.L2), 7-SOM PIO (U7.57)
PD21/EEPROM_TWD_PD21: 5-Memories (R27.1), 7-SOM PIO (U7.19)
PD22/EEPROM_TWCK_PD22: 5-Memories (R26.1), 7-SOM PIO (U7.20)
PD23/DBGU_RXD: 3-Microcontroller (U2.T1), 7-SOM PIO (U7.30)
PD24/DBGU_TXD: 3-Microcontroller (U2.L4), 7-SOM PIO (U7.29)
PD25/AD6: 3-Microcontroller (U2.L5), 7-SOM PIO (U7.110)
PD26/AD7: 3-Microcontroller (U2.R1), 7-SOM PIO (U7.34)
PD27/JTAG_TCK: 3-Microcontroller (U2.L7), 7-SOM PIO (U7.53)
PD28/JTAG_TDI: 3-Microcontroller (U2.L3), 7-SOM PIO (U7.51)
PD29/JTAG_TDO: 3-Microcontroller (U2.M2), 7-SOM PIO (U7.52)
PD30/JTAG_TMS: 3-Microcontroller (U2.M9), 7-SOM PIO (U7.54)
PIOBU1: 4-Microcontroller (U2.M3), 7-SOM PIO (U7.33)
PIOBU2: 4-Microcontroller (U2.P2), 7-SOM PIO (U7.44)
PIOBU3: 4-Microcontroller (U2.P4), 7-SOM PIO (U7.48)
PIOBU4: 4-Microcontroller (U2.N4), 7-SOM PIO (U7.47)
PIOBU5: 4-Microcontroller (U2.M5), 7-SOM PIO (U7.46)
PIOBU6: 4-Microcontroller (U2.N5), 7-SOM PIO (U7.59)
PIOBU7: 4-Microcontroller (U2.N3), 7-SOM PIO (U7.45)
QSPI_CS_PB06: 3-Microcontroller (U2.A9), 5-Memories (R34.1 R39.2 R44.2)
QSPI_IO0_PB07: 3-Microcontroller (U2.D5), 5-Memories (R32.1 R36.1 R42.1)
QSPI_IO1_PB08: 3-Microcontroller (U2.E5), 5-Memories (R31.1 R37.1 R43.1)
QSPI_IO2_PB09: 3-Microcontroller (U2.C6), 5-Memories (R30.1 R38.1 R45.1)
QSPI_IO3_PB10: 3-Microcontroller (U2.A8), 5-Memories (R29.1 R40.1 R46.1)
QSPI_SCK_PB05: 3-Microcontroller (U2.A10), 5-Memories (R28.1 R41.1 R47.1)
RXD: 4-Microcontroller (U2.N2), 7-SOM PIO (U7.32)
SHDN: 2-Supplies (Q1.2), 4-Microcontroller (R15.1), 7-SOM PIO (U7.35)
STROBE: 4-Microcontroller (U2.U12), 7-SOM PIO (U7.73)
USBA_M: 4-Microcontroller (U2.T10), 7-SOM PIO (U7.67)
USBA_P: 4-Microcontroller (U2.U10), 7-SOM PIO (U7.68)
USBB_M: 4-Microcontroller (U2.T11), 7-SOM PIO (U7.70)
USBB_P: 4-Microcontroller (U2.U11), 7-SOM PIO (U7.71)
WKUP: 4-Microcontroller (R11.1), 7-SOM PIO (U7.49)